# EAGLE design openautopihatv1point1 (EAGLE 8.3.1)
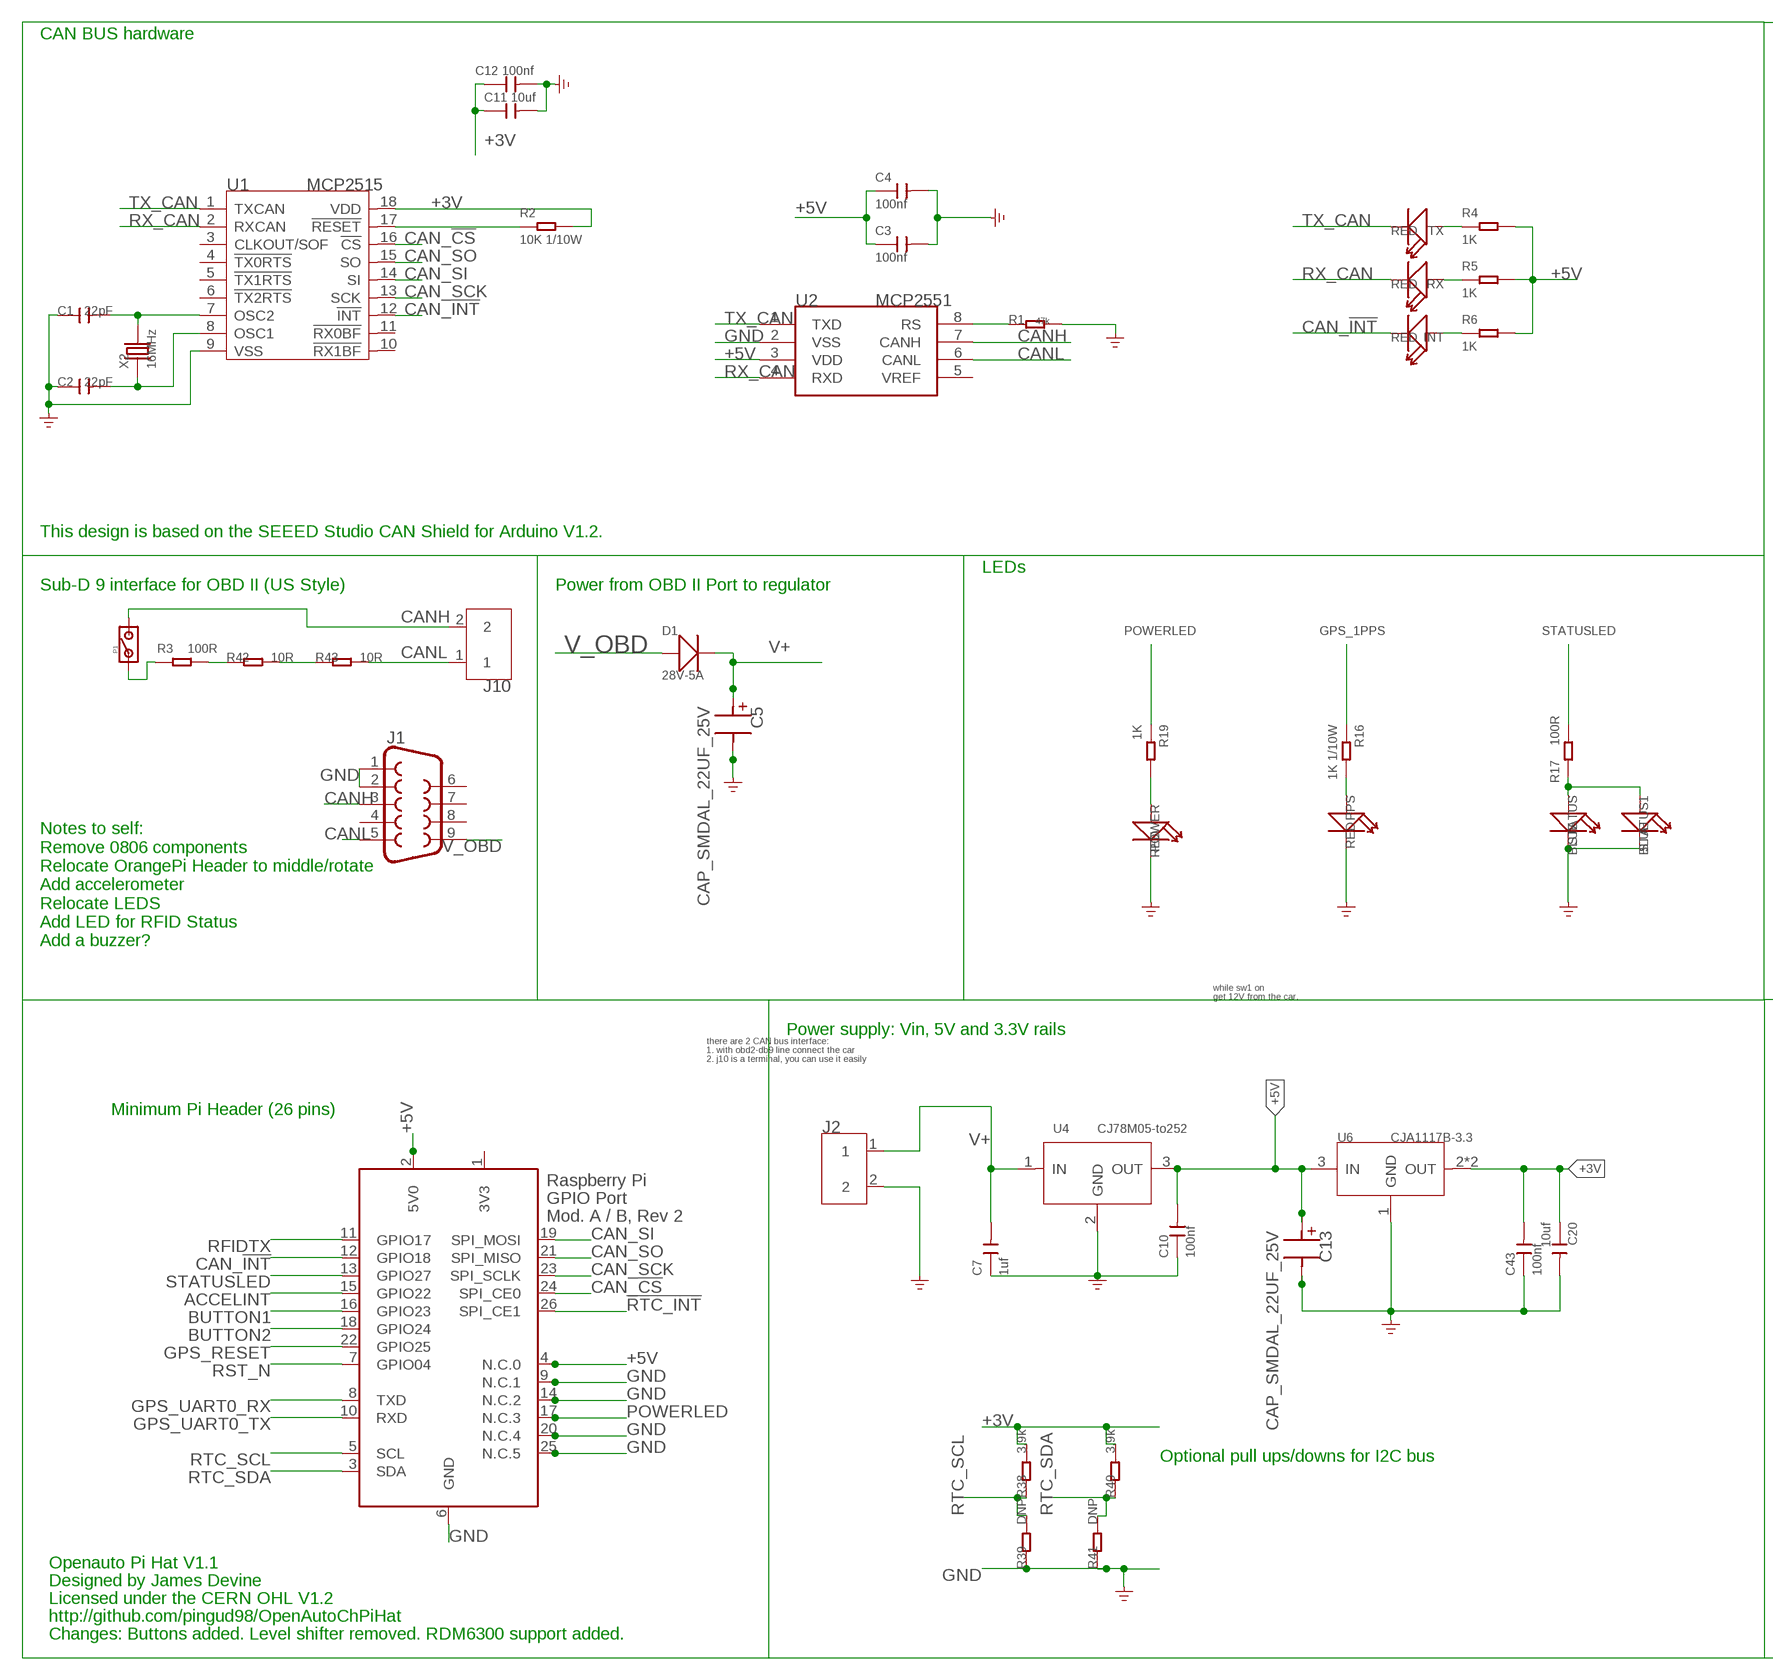
[diagram p0: schematic, sheet 1, part 1 of 2]
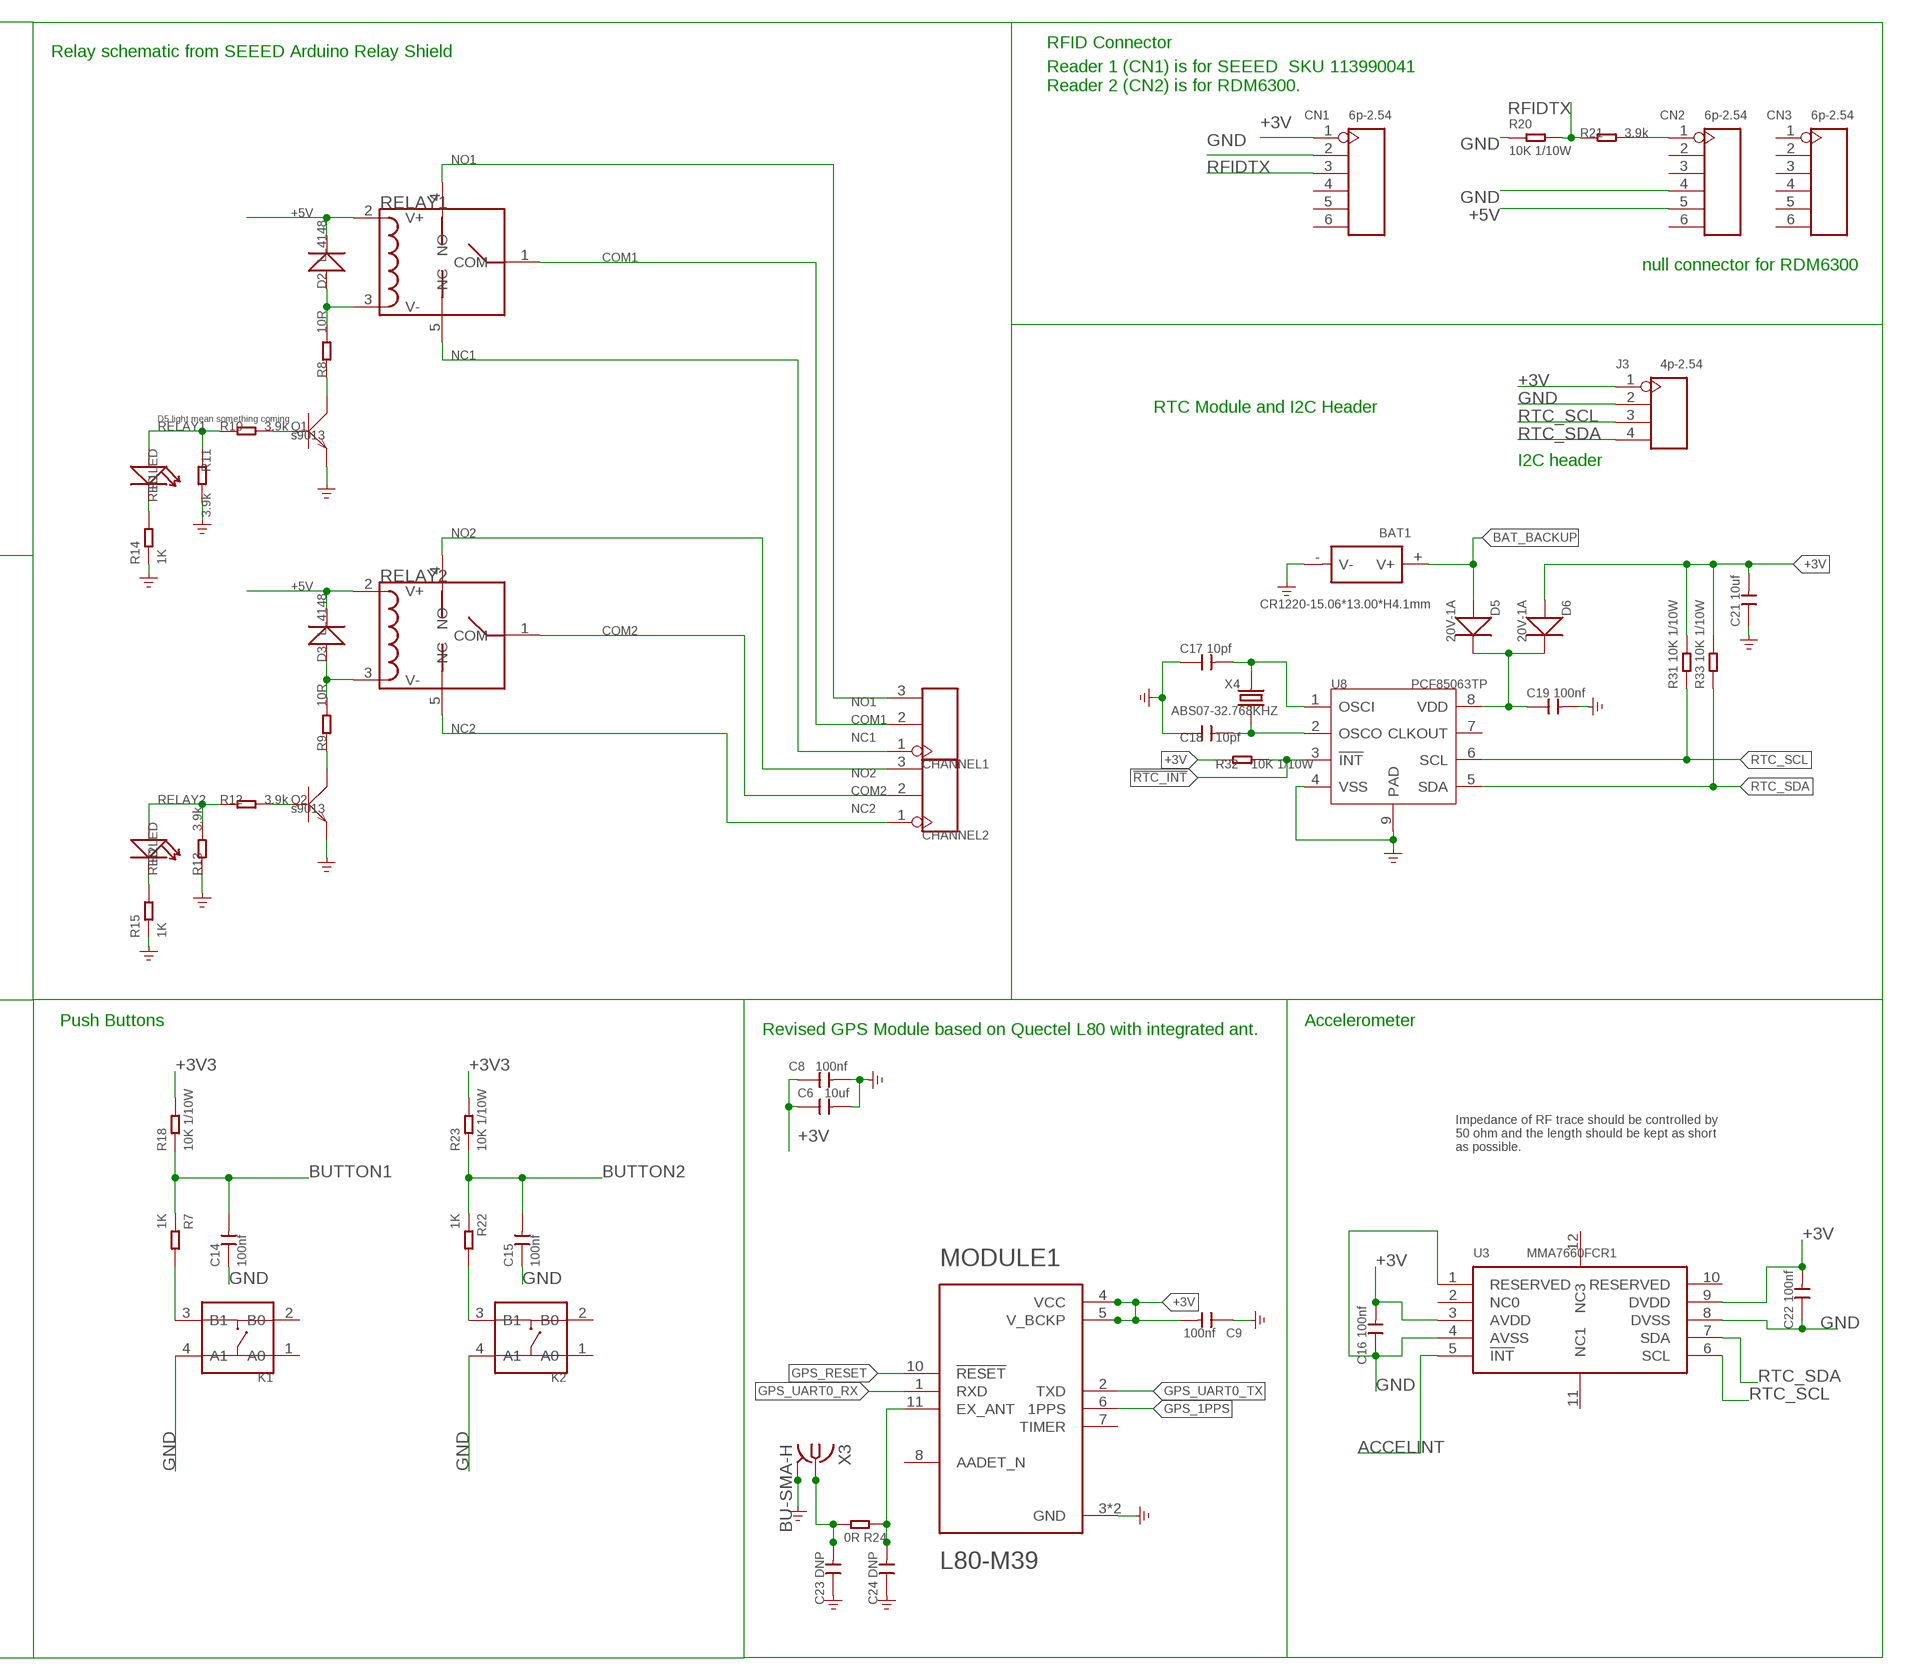
[diagram p1: schematic, sheet 1, part 2 of 2]

## Parts
BAT1  CR1220-15.06*13.00*H4.1mm  BAT-HOLDER'SMD-1220'  [BAT2P-SMD-16.4-CR1220]
C1  22pF  C-0603  [C0603]
C2  22pF  C-0603  [C0603]
C3  100nf  CERAMIC-100NF-50V-10%-X7R(0603)  [C0603]
C4  100nf  CERAMIC-100NF-50V-10%-X7R(0603)  [C0603]
C5  CAP_SMDAL_22UF_25V  [CAP_SMD_AL_D50]
C6  10uf  CERAMIC-10UF-25V-10%-X5R(0805)  [C0805]
C7  1uf  CERAMIC-1UF-25V-10%-X7R(0603)  [C0603]
C8  100nf  CERAMIC-100NF-50V-10%-X7R(0603)  [C0603]
C9  100nf  CERAMIC-100NF-50V-10%-X7R(0603)  [C0603]
C10  100nf  CERAMIC-100NF-50V-10%-X7R(0603)  [C0603]
C11  10uf  CERAMIC-10UF-25V-10%-X5R(0805)  [C0805]
C12  100nf  CERAMIC-100NF-50V-10%-X7R(0603)  [C0603]
C13  CAP_SMDAL_22UF_25V  [CAP_SMD_AL_D50]
C14  100nf  CERAMIC-100NF-50V-10%-X7R(0603)  [C0603]
C15  100nf  CERAMIC-100NF-50V-10%-X7R(0603)  [C0603]
C16  100nf  CERAMIC-100NF-50V-10%-X7R(0603)  [C0603]
C17  10pf  CERAMIC-10PF-50V-5%-NPO(0603)  [C0603]
C18  10pf  CERAMIC-10PF-50V-5%-NPO(0603)  [C0603]
C19  100nf  CERAMIC-100NF-50V-10%-X7R(0603)  [C0603]
C20  10uf  CERAMIC-10UF-25V-10%-X5R(0805)  [C0805]
C21  10uf  CERAMIC-10UF-25V-10%-X5R(0805)  [C0805]
C22  100nf  CERAMIC-100NF-50V-10%-X7R(0603)  [C0603]
C23  DNP  CERAMIC-1NF-50V-5%-C0G(0603)  [C0603]
C24  DNP  CERAMIC-1NF-50V-5%-C0G(0603)  [C0603]
C43  100nf  CERAMIC-100NF-50V-10%-X7R(0603)  [C0603]
CHANNEL1  SCREW-TERMINAL-3P'3.5'  [3P-3.5]
CHANNEL2  SCREW-TERMINAL-3P'3.5'  [3P-3.5]
CN1  6p-2.54  DIP-BLACK-FEMALE-HEADER-VERT(6P-2.54)  [H6-2.54]
CN2  6p-2.54  DIP-BLACK-FEMALE-HEADER-VERT(6P-2.54)  [H6-2.54]
CN3  6p-2.54  DIP-BLACK-FEMALE-HEADER-VERT(6P-2.54)  [H6-2.54]
D1  28V-5A  SMD-DIODE-SCHOTTKY-28V-5A(DO-214AA)  [DO-214AA]
D2  LL4148  D'1N4148-SMD'  [LL-34]
D3  LL4148  D'1N4148-SMD'  [LL-34]
D5  20V-1A  SMD-DIODE-SCHOTTKY-20V-1A(SOD-123)  [SOD-123]
D6  20V-1A  SMD-DIODE-SCHOTTKY-20V-1A(SOD-123)  [SOD-123]
INT  RED  LED'0603'  [LED-0603]
J1  DB9MALE  [DB9_MALE]
J2  SCREW-TERMINAL-2P5.0  [2P-5.0]
J3  4p-2.54  DIP-BLACK-FEMALE-HEADER-VERT(4P-2.54)  [H4-2.54]
J10  SCREW-TERMINAL-2P5.0  [2P-5.0]
K1  DIP-SWITCH-TACTILE-SPST-NO/TS-1109(4P-D6.0MM)'TS-1109'  [SW4-6.0X6.0X5.0MM]
K2  DIP-SWITCH-TACTILE-SPST-NO/TS-1109(4P-D6.0MM)'TS-1109'  [SW4-6.0X6.0X5.0MM]
MODULE1  L80-M39  [QUECTEL_L80-M39]
P1  PAD-JUMPER-2P  [2P-SMD-1.78X1.27]
POWER  RED  LED'0603'  [LED-0603]
PPS  RED  LED'0603'  [LED-0603]
Q1  s9013  TRANSISTOR-NPN-SOT23  [SOT23]
Q2  s9013  TRANSISTOR-NPN-SOT23  [SOT23]
R1  47k  R-0603  [0603]
R1LED  RED  LED'0603'  [LED-0603]
R2  10K 1/10W  SMD-RES-10K-5%-1/10W(0603)  [R0603]
R2LED  RED  LED'0603'  [LED-0603]
R3  100R  SMD-RES-100R-5%-1/10W(0603)  [R0603]
R4  1K  SMD-RES-1K-1%-1/10W(0603)  [R0603]
R5  1K  SMD-RES-1K-1%-1/10W(0603)  [R0603]
R6  1K  SMD-RES-1K-1%-1/10W(0603)  [R0603]
R7  1K  SMD-RES-1K-1%-1/10W(0603)  [R0603]
R8  10R  R-0603  [R0603]
R9  10R  R-0603  [R0603]
R10  3.9k  R-0603  [R0603]
R11  3.9k  R-0603  [R0603]
R12  3.9k  R-0603  [R0603]
R13  3.9k  R-0603  [R0603]
R14  1K  SMD-RES-1K-1%-1/10W(0603)  [R0603]
R15  1K  SMD-RES-1K-1%-1/10W(0603)  [R0603]
R16  1K 1/10W  SMD-RES-1K-5%-1/10W(0603)  [R0603]
R17  100R  SMD-RES-100R-5%-1/10W(0603)  [R0603]
R18  10K 1/10W  SMD-RES-10K-5%-1/10W(0603)  [R0603]
R19  1K  SMD-RES-1K-1%-1/10W(0603)  [R0603]
R20  10K 1/10W  SMD-RES-10K-5%-1/10W(0603)  [R0603]
R21  3.9k  R-0603  [R0603]
R22  1K  SMD-RES-1K-1%-1/10W(0603)  [R0603]
R23  10K 1/10W  SMD-RES-10K-5%-1/10W(0603)  [R0603]
R24  0R  SMD-RES-0R-5%-1/10W(0603)  [R0603]
R31  10K 1/10W  SMD-RES-10K-5%-1/10W(0603)  [R0603]
R32  10K 1/10W  SMD-RES-10K-5%-1/10W(0603)  [R0603]
R33  10K 1/10W  SMD-RES-10K-5%-1/10W(0603)  [R0603]
R38  3.9k  R-0603  [R0603]
R39  DNP  R-0603  [R0603]
R40  3.9k  R-0603  [R0603]
R41  DNP  R-0603  [R0603]
R42  10R  R-0603  [R0603]
R43  10R  R-0603  [R0603]
RELAY1  RELAY-HLS8L-DC5V-S-C  [5P-19.0X15.5X15.8H]
RELAY2  RELAY-HLS8L-DC5V-S-C  [5P-19.0X15.5X15.8H]
RX  RED  LED'0603'  [LED-0603]
STATUS  BLUE  LED'0603'  [LED-0603]
STATUS1  BLUE  LED'0603'  [LED-0603]
TX  RED  LED'0603'  [LED-0603]
U1  MCP2515  MCP2515-SOIC18  [SOIC18]
U2  MCP2551  MCP2551-SOIC8  [SOIC8-6.0]
U3  MMA7660FCR1  MOTION/POSITION-MMA7660FCR1(DFN10)  [DFN10-0.5-3.0X3.0MM]
U4  CJ78M05-to252  PMIC-CJ78M05(TO-252)  [TO-252]
U6  CJA1117B-3.3  PMIC-CJ1117'SOT89'  [SOT-89]
U8  PCF85063TP  RTC-PCF85063TP  [HWSON8-0.5-2X3X0.75MM]
X1  RASPI_GPIO_AB_PIN  [RASPI_GPIO_AB_PIN]
X2  16MHz  CRYSTAL-HC49S  [HC49/S]
X3  BU-SMA-H  [BU-SMA-H]
X4  ABS07-32.768KHZ  CRYSTAL-2P-3215  [X2-SMD-3.2X1.5X0.55MM]

## Nets
!RTC_INT: R32.2 U8.3(!INT) X1.26(SPI_CE1)
+3V: C6.1 C8.1 C9.2 C11.1 C12.1 C16.2 C20.1 C21.2 C22.2 C43.2 CN1.1 D6.+ J3.1 MODULE1.4(VCC) MODULE1.5(V_BCKP) R2.2 R31.2 R32.1 R33.2 R38.2 R40.2 U1.18(VDD) U3.3(AVDD) U3.9(DVDD) U6.2(OUT) U6.4(OUT)
+3V3: R18.2 R23.2
+5V [5V Line]: C3.1 C4.1 C10.2 C13.P$P CN2.5 D2.C(-) D3.C(-) R4.2 R5.2 R6.2 RELAY1.2(V+) RELAY2.2(V+) U2.3(VDD) U4.3(OUT) U6.3(IN) X1.2(5V0) X1.4(N.C.0)
ACCELINT: U3.5(!INT) X1.15(GPIO22)
BAT_BACKUP: BAT1.+(V+) D5.+
BUTTON1: C14.2 R7.1 R18.1 X1.16(GPIO23)
BUTTON2: C15.2 R22.1 R23.1 X1.18(GPIO24)
CAN_!CS: U1.16(!CS) X1.24(SPI_CE0)
CAN_!INT: INT.- U1.12(!INT) X1.12(GPIO18)
CAN_SCK: U1.13(SCK) X1.23(SPI_SCLK)
CAN_SI: U1.14(SI) X1.19(SPI_MOSI)
CAN_SO: U1.15(SO) X1.21(SPI_MISO)
CANH: J1.3 J10.2 P1.2 U2.7(CANH)
CANL: J1.5 J10.1 R43.2 U2.6(CANL)
COM1: CHANNEL1.2 RELAY1.1(COM)
COM2: CHANNEL2.2 RELAY2.1(COM)
GND [Batt]: BAT1.-(V-) C1.1 C2.1 C3.2 C4.2 C5.P$M C6.2 C7.1 C8.2 C9.1 C10.1 C11.2 C12.2 C13.P$M C14.1 C15.1 C16.1 C17.1 C18.1 C19.2 C20.2 C21.1 C22.1 C23.1 C24.1 C43.1 CN1.2 CN2.4 J1.1 J1.2 J2.2 J3.2 K1.4(A1) K2.4(A1) MODULE1.3(GND) MODULE1.12(GND) POWER.- PPS.- Q1.2(E) Q2.2(E) R1.2 R11.2 R13.1 R14.1 R15.1 R20.1 R39.1 R41.1 STATUS1.- STATUS.- U1.9(VSS) U2.2(VSS) U3.1(RESERVED) U3.4(AVSS) U3.8(DVSS) U4.2(GND) U6.1(GND) U8.4(VSS) U8.9(PAD) X1.6(GND) X1.9(N.C.1) X1.14(N.C.2) X1.20(N.C.4) X1.25(N.C.5) X3.2 X3.3 X3.4 X3.5 ; supply symbol labelled GND_POWER
GPS_1PPS: MODULE1.6(1PPS) R16.1
GPS_RESET: MODULE1.10(!RESET) X1.22(GPIO25)
GPS_UART0_RX: MODULE1.1(RXD) X1.8(TXD)
GPS_UART0_TX: MODULE1.2(TXD) X1.10(RXD)
N$1: K1.3(B1) R7.2
N$2: R4.1 TX.+
N$4 [5V Line]: Q2.1(B) R12.2
N$5 [5V Line]: D3.A(+) R9.2 RELAY2.3(V-)
N$6 [5V Line]: Q1.3(C) R8.1
N$7 [5V Line]: D2.A(+) R8.2 RELAY1.3(V-)
N$8 [5V Line]: Q2.3(C) R9.1
N$9: PPS.+ R16.2
N$10: R17.2 STATUS1.+ STATUS.+
N$11: R3.1 R42.1
N$12: R1LED.- R14.2
N$13: R2LED.- R15.2
N$14: C24.2 MODULE1.11(EX_ANT) R24.1
N$15: R5.1 RX.+
N$16: C1.2 U1.7(OSC2) X2.2
N$17: C2.2 U1.8(OSC1) X2.1
N$18: C23.2 R24.2 X3.1
N$19: INT.+ R6.1
N$20: R1.1 U2.8(RS)
N$23 [5V Line]: Q1.1(B) R10.2
N$24: CN2.1 R21.2
N$25: K2.3(B1) R22.2
N$29: POWER.+ R19.2
N$30: P1.1 R3.2
N$40: C18.2 U8.2(OSCO) X4.1
N$41: C17.2 U8.1(OSCI) X4.2
N$45: R42.2 R43.1
N$49: C19.1 D5.- D6.- U8.8(VDD)
NC1: CHANNEL1.1 RELAY1.5(NC)
NC2: CHANNEL2.1 RELAY2.5(NC)
NO1: CHANNEL1.3 RELAY1.4(NO)
NO2: CHANNEL2.3 RELAY2.4(NO)
POWERLED: R19.1 X1.17(N.C.3)
RELAY1 [5V Line]: R1LED.+ R10.1 R11.1
RELAY2: R2LED.+ R12.1 R13.2
RFIDTX: CN1.3 R20.2 R21.1 X1.11(GPIO17)
RST_N: R2.1 U1.17(!RESET) X1.7(GPIO04)
RTC_SCL: J3.3 R31.1 R38.1 R39.2 U3.6(SCL) U8.6(SCL) X1.5(SCL)
RTC_SDA: J3.4 R33.1 R40.1 R41.2 U3.7(SDA) U8.5(SDA) X1.3(SDA)
RX_CAN: RX.- U1.2(RXCAN) U2.4(RXD)
STATUSLED: R17.1 X1.13(GPIO27)
TX_CAN: TX.- U1.1(TXCAN) U2.1(TXD)
V+ [Batt]: C5.P$P C7.2 D1.- J2.1 U4.1(IN)
V_OBD [Batt]: D1.+ J1.9
Unconnected: CN1.4 CN1.5 CN1.6 CN2.2 CN2.3 CN2.6 CN3.1 CN3.2 CN3.3 CN3.4 CN3.5 CN3.6 J1.4 J1.6 J1.7 J1.8 K1.1(A0) K1.2(B0) K2.1(A0) K2.2(B0) MODULE1.7(TIMER) MODULE1.8(AADET_N) U1.3(CLKOUT/SOF) U1.4(!TX0RTS) U1.5(!TX1RTS) U1.6(!TX2RTS) U1.10(!RX1BF) U1.11(!RX0BF) U2.5(VREF) U3.2(NC0) U3.10(RESERVED) U3.11(NC1) U3.12(NC3) U8.7(CLKOUT)

## Notes on the sheet
- CAN BUS hardware
- RFID Connector
- Relay schematic from SEEED Arduino Relay Shield
- Reader 1 (CN1) is for SEEED  SKU 113990041
  Reader 2 (CN2) is for RDM6300.
- null connector for RDM6300
- RTC Module and I2C Header
- D5 light mean something coming
- I2C header
- This design is based on the SEEED Studio CAN Shield for Arduino V1.2.
- LEDs
- Sub-D 9 interface for OBD II (US Style) | Power from OBD II Port to regulator
- Notes to self:
  Remove 0806 components
  Relocate OrangePi Header to middle/rotate
  Add accelerometer
  Relocate LEDS
  Add LED for RFID Status
  Add a buzzer?
- while sw1 on
- get 12V from the car,
- Push Buttons | Accelerometer
- Power supply: Vin, 5V and 3.3V rails | Revised GPS Module based on Quectel L80 with integrated ant.
- there are 2 CAN bus interface:
- 1. with obd2-db9 line connect the car
- 2. j10 is a terminal, you can use it easily
- Minimum Pi Header (26 pins)
- Impedance of RF trace should be controlled by 
  50 ohm and the length should be kept as short 
  as possible.
- short route
- Optional pull ups/downs for I2C bus
- Openauto Pi Hat V1.1
- Designed by James Devine
- Licensed under the CERN OHL V1.2
- http://github.com/pingud98/OpenAutoChPiHat
- Changes: Buttons added. Level shifter removed. RDM6300 support added.

## Power pins joined to a net without a drawn wire
3V3: X1.1(3V3)

## Library data of the parts
BAT1 = Connector-new:BAT-HOLDER: BAT2P-13.5-CR1220:320170002;BAT2P-SMD-20.5-CR1632:320170007;METAL-CR2032-D20.0*H6.3MM:320170003;METAL-CR2032-SMD:320170006;PLASTIC-CR1220-L15.06*W13.0*H4.1MM:320170000;PLASTIC-CR2032-L25.2*W15.6*H5.2MM:320170005;BAT2P-11.55-D12.55-CR1220:313010022
C1 C2 = Discrete:C*: Ceramic Capacitors
C3 C4 C8-C10 C12 C14-C16 C19 C22 C43 = Seeed-Capacitor:CERAMIC-100NF-50V-10%-X7R(0603): 302010138; MPN: CC0603KRX7R9BB104
C5 C13 = Seeed-OPL-2017-01-Capacitor-akita:CAP_SMDAL_22UF_25V: SMD CAP Aluminum 22uF-25V;D5.0*H5.4mm SKU: 302030003
C6 C11 C20 C21 = Seeed-Capacitor:CERAMIC-10UF-25V-10%-X5R(0805): 302010178; MPN: CC0805KKX5R8BB106
C7 = Seeed-Capacitor:CERAMIC-1UF-25V-10%-X7R(0603): 302010139; MPN: CC0603KRX7R8BB105
C17 C18 = Seeed-Capacitor:CERAMIC-10PF-50V-5%-NPO(0603): 302010097; MPN: CC0603JRNPO9BN100
C23 C24 = Seeed-Capacitor:CERAMIC-1NF-50V-5%-C0G(0603): 302010341; MPN: GRM1885C1H102JA01D; VALUE: 1nf
CHANNEL1 CHANNEL2 = Connector :SCREW-TERMINAL-3P
CN1-CN3 = Seeed-Connector:DIP-BLACK-FEMALE-HEADER-VERT(6P-2.54): 320030060; MPN: F185-1106A1BSYC1
D1 = Seeed-Diode:SMD-DIODE-SCHOTTKY-28V-5A(DO-214AA): 304020021; MPN: SS54B
D2 D3 = discrete:D*
D5 D6 = Seeed-Diode:SMD-DIODE-SCHOTTKY-20V-1A(SOD-123): 304020034; MPN: B5819W
INT POWER PPS R1LED R2LED RX STATUS STATUS1 TX = Discrete:LED*
J1 = SparkFun-Connectors:DB9: DB9 Connector Standard DB9 (D-Sub 9) serial connector. Can be used for CAN bus as well as RS485 and RS232. Footprint production proven. Here is the female version connector we sell at SparkFun: 9 Pin Female Serial Connector - PCB Mount <https://www.sparkfun.com/products/429> (PRT-00429) This connector has been used on the following SparkFun products: SparkFun RS232 Shifter - SMD <https://www.sparkfun.com/products/449> (PRT-00449) SparkFun RS232 Shifter SMD (No DB9) <https://www.sparkfun.com/products/8780> (PRT-08780); PROD_ID: CONN-09904
J2 J10 = Connector:SCREW-TERMINAL-2P
J3 = Seeed-Connector:DIP-BLACK-FEMALE-HEADER-VERT(4P-2.54): 320030017; MPN: F185-1104A1BSYA1
K1 K2 = Seeed-Switch:DIP-SWITCH-TACTILE-SPST-NO/TS-1109(4P-D6.0MM): 311020024
MODULE1 = L80-M39:L80-M39: GPS Receiver 1575.42MHz 3.3V 12-Pin; AVAILABILITY: Unavailable; DESCRIPTION: GPS Receiver 1575.42MHz 3.3V 12-Pin; MF: Quectel; MP: L80-M39; PACKAGE: None; PRICE: 7.60 USD
P1 = Discrete:PAD-JUMPER-2P
Q1 Q2 = discrete:TRANSISTOR-NPN*: NPN audion
R1 = Discrete:R*
R2 R18 R20 R23 R31-R33 = Seeed-Resistor:SMD-RES-10K-5%-1/10W(0603): 301010293; MPN: RC0603JR-0710KL
R3 R17 = Seeed-Resistor:SMD-RES-100R-5%-1/10W(0603): 301010090; MPN: RC0603JR-07100RL
R4-R7 R14 R15 R19 R22 = Seeed-Resistor:SMD-RES-1K-1%-1/10W(0603): 301010298; MPN: RC0603FR-071KL
R8-R13 R21 R38-R43 = discrete:R*
R16 = Seeed-Resistor:SMD-RES-1K-5%-1/10W(0603): 301010291; MPN: RC0603JR-071KL
R24 = Seeed-Resistor:SMD-RES-0R-5%-1/10W(0603): 301010292; MPN: RC0603JR-070RL
RELAY1 RELAY2 = discrete:RELAY-HLS8L-DC5V-S-C
U1 = IC:MCP2515: Stand-Alone CAN Controller With SPI Interface
U2 = IC:MCP2551: High-Speed CAN Transceiver http://ww1.microchip.com/downloads/en/devicedoc/21667f.pdf
U3 = Seeed-Sensor:MOTION/POSITION-MMA7660FCR1(DFN10): 314080009; MPN: MMA7660FCR1
U4 = Seeed-IC:PMIC-CJ78M05(TO-252): 310030100; MPN: CJ78M05
U6 = IC-new:PMIC-CJ*1117: Low Drop Fixed And Adjustable Positive Voltage Regulators http://www.datasheetcatalog.org/datasheet/SGSThomsonMicroelectronics/mXuqtqv.pdf
U8 = IC-new:RTC-PCF85063TP
X1 = raspberrypi_bastelstube_v13:RASPI_GPIO_AB: Only the 2x13 header connector, nothing else
X2 = Discrete:CRYSTAL*: CRYSTAL
X3 = con-coax:BU-SMA-H: FEMALE SMA CONNECTOR Radiall; OC_FARNELL: unknown; OC_NEWARK: unknown
X4 = Discrete-new:CRYSTAL-2P

## Net classes
0 default: width 0.152 mm, drill 0.152 mm, clearance 0.152 mm
1 Batt: width 0.305 mm, drill 0.152 mm, clearance 0.152 mm
2 5V Line: width 0.203 mm, drill 0.152 mm, clearance 0.152 mm

## Board
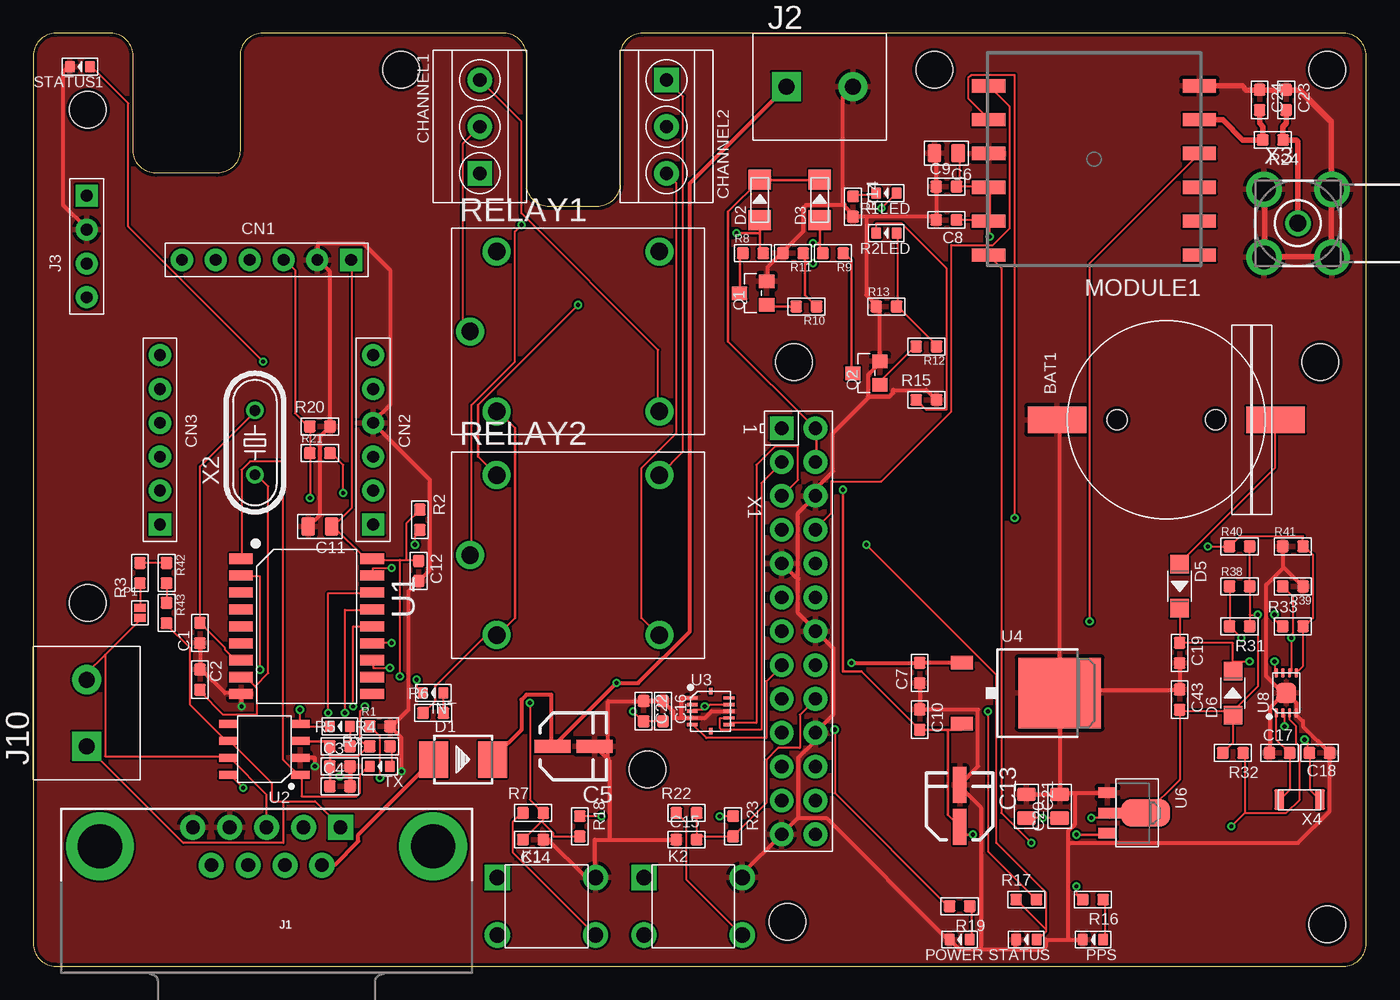
[diagram p2: board, top side]
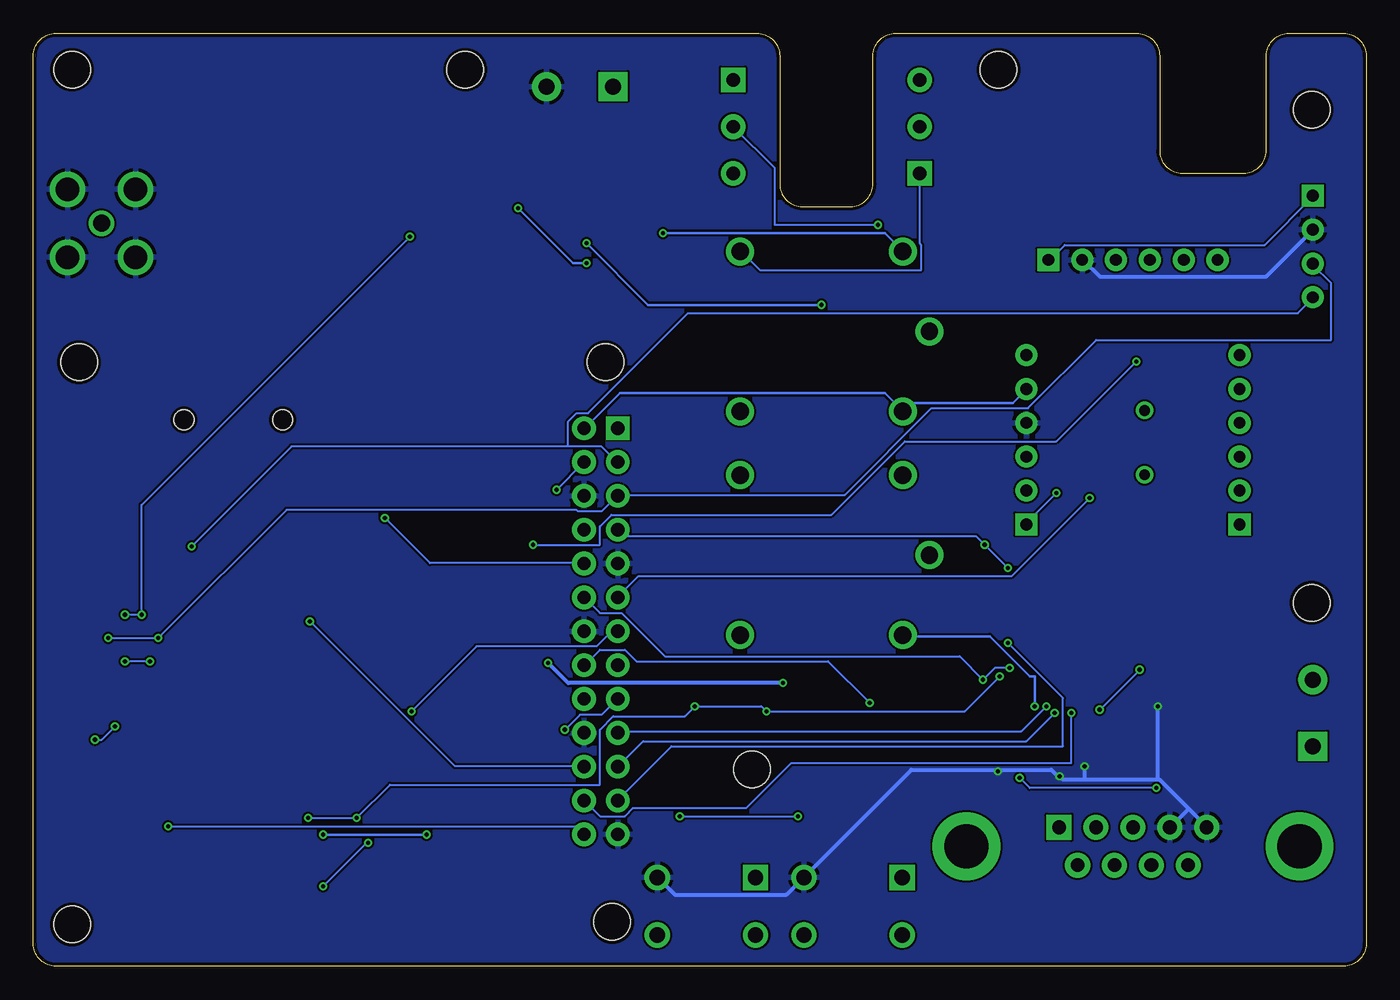
[diagram p3: board, bottom side, seen from below]

Size 100 x 70 mm. Coordinates in mm from the lower left corner, seen from the top.
Outline: 0,68.29 0,1.71 arc90 1.71,0 98.29,0 arc90 100,1.71 100,68.29 arc90 98.29,70 45.71,70 arc90 44,68.29 44,58.71 arc-90 42.29,57 38.71,57 arc-90 37,58.71 37,68.29 arc90 35.29,70 17.21,70 arc90 15.5,68.29 15.5,61.21 arc-90 13.79,59.5 9.21,59.5 arc-90 7.5,61.21 7.5,68.29 arc90 5.79,70 1.71,70 arc90 0,68.29
Copper layers (1*16): Top 0.035mm / dielectric 1.5mm / Bottom 0.035mm
Design rules "SeeedStudio_2layer_DRU_no_angle_20140221": minimum track width 6mil, minimum drill 12mil, track to track 6mil, track to pad 6mil, pad to pad 6mil, via to via 6mil, smd to smd 0mil, copper to edge 10mil, drill to drill 10mil, minimum pad ring 10mil, minimum via ring 6mil, stop-mask expansion 2mil, vias tented up to drill 100mil, thermal gap 10mil
Holes 2.75 mm at 97.09,3.13 97.09,67.27 96.57,45.33 4.09,64.27 4.09,27.27 57.07,45.33 56.57,3.33 27.59,67.27 67.59,67.27 46.09,14.77

### Footprints (pad centres in the part's own frame; a part is rotated, then mirrored left to right if it is on the bottom)
BAT2P-SMD-16.4-CR1220 = smd 2 x 4.4: + 0,-8.2; - 0,8.2 | hole 1.5: 0,3.7; 0,-3.7
C0603 = smd 0.889 x 0.889: 1 -0.762,0; 2 0.762,0
C0603' = smd 0.889 x 0.889: 1 0,0.762; 2 0,-0.762
CAP_SMD_AL_D50 = smd 1 x 2.7: P$M 0,-1.6; P$P 0,1.56
C0805 = smd 1.397 x 1.016: 1 0,0.889; 2 0,-0.889
3P-3.5 = drill 1 pad 1.85 square: 1 0,-3.5 | drill 1 pad 1.85: 2 0,0; 3 0,3.5
H6-2.54 = drill 0.889 pad 1.651 square: 1 0,6.35 | drill 0.889 pad 1.651: 2 0,3.81; 3 0,1.27; 4 0,-1.27; 5 0,-3.81; 6 0,-6.35
DO-214AA = smd 2.159 x 2.743: + -2.21,0; - 2.21,0
LL-34 = smd 1.524 x 1.676: A -1.524,0; C 1.524,0
SOD-123 = smd 1.397 x 1.397: + -1.651,0; - 1.651,0
LED-0603 = smd 0.762 x 0.889: + -0.762,0; - 0.762,0
DB9_MALE = drill 1.016 pad 1.88: 1 5.54,-1.42; 2 2.77,-1.42; 3 0,-1.42; 4 -2.77,-1.42; 6 4.15,1.42; 7 1.38,1.42; 8 -1.38,1.42; 9 -4.15,1.42 | drill 1.016 pad 1.88 square: 5 -5.54,-1.42 | drill 3.302 pad 5.08: G1 -12.5,0; G2 12.5,0
2P-5.0 = drill 1.2 pad 2.184 square: 1 0,0 | drill 1.2 pad 2.184: 2 5,0
H4-2.54 = drill 0.889 pad 1.651 square: 1 0,3.81 | drill 0.889 pad 1.651: 2 0,1.27; 3 0,-1.27; 4 0,-3.81
SW4-6.0X6.0X5.0MM = drill 1.143 pad 1.905 square: 1 -3.683,2.159 | drill 1.143 pad 1.905: 2 -3.683,-2.159; 3 3.683,-2.159; 4 3.683,2.159
QUECTEL_L80-M39 = smd 2.5 x 1: 1 7.9,-5.5; 2 7.9,-2.96; 3 7.9,-0.42; 4 7.9,2.12; 5 7.9,4.66; 6 7.9,7.2; 7 -7.9,7.2; 8 -7.9,4.66; 9 -7.9,2.12; 10 -7.9,-0.42; 11 -7.9,-2.96; 12 -7.9,-5.5
2P-SMD-1.78X1.27 = smd 0.889 x 0.61: 1 0,0.381; 2 0,-0.381
SOT23 = smd 1.016 x 1.143: 1 -0.889,-1.016; 2 0.889,-1.016; 3 0,1.016
0603 = smd 0.889 x 0.889: 1 -0.762,0; 2 0.762,0
R0603 = smd 0.889 x 0.889: 1 0,0.762; 2 0,-0.762
R0603' = smd 0.889 x 0.889: 1 -0.762,0; 2 0.762,0
5P-19.0X15.5X15.8H = drill 1.3 pad 2.1: 1 -8.1,0; 2 -6.1,-6; 3 -6.1,6; 4 6.1,-6; 5 6.1,6
SOIC18 = smd 0.762 x 1.778: 1 -5.08,-4.915; 2 -3.81,-4.915; 3 -2.54,-4.915; 4 -1.27,-4.915; 5 0,-4.915; 6 1.27,-4.915; 7 2.54,-4.915; 8 3.81,-4.915; 9 5.08,-4.915; 10 5.08,4.915; 11 3.81,4.915; 12 2.54,4.915; 13 1.27,4.915; 14 0,4.915; 15 -1.27,4.915; 16 -2.54,4.915; 17 -3.81,4.915; 18 -5.08,4.915
SOIC8-6.0 = smd 0.6 x 1.4: 1 -1.905,-2.7; 2 -0.635,-2.7; 3 0.635,-2.7; 4 1.905,-2.7; 5 1.905,2.7; 6 0.635,2.7; 7 -0.635,2.7; 8 -1.905,2.7
DFN10-0.5-3.0X3.0MM = smd 0.8 x 0.25: 1 -1.375,1; 2 -1.375,0.5; 3 -1.375,0; 4 -1.375,-0.5; 5 -1.375,-1; 6 1.375,-1; 7 1.375,-0.5; 8 1.375,0; 9 1.375,0.5; 10 1.375,1 | smd 0.25 x 0.5: 11 0,-1.5; 12 0,1.5
TO-252 = smd 1.016 x 1.651: 1 -2.286,-4.826; 3 2.286,-4.826 | smd 5.3 x 6.2: 2 0,2.5
SOT-89 = smd 0.8 x 1.4: 1 -1.524,-1.905; 3 1.524,-1.905 | smd 0.8 x 1.9: 2 0,-1.651 | smd 2.032 x 3.65: 4 0,0.94
HWSON8-0.5-2X3X0.75MM = smd 0.25 x 0.7: 1 -0.75,-1.5; 2 -0.25,-1.5; 3 0.25,-1.5; 4 0.75,-1.5; 5 0.75,1.5; 6 0.25,1.5; 7 -0.25,1.5; 8 -0.75,1.5 | smd 1.5 x 1.5: 9 0,0
RASPI_GPIO_AB_PIN = drill 1 pad 1.778 square: 1 -15.24,-1.27 | drill 1 pad 1.778: 2 -15.24,1.27; 3 -12.7,-1.27; 4 -12.7,1.27; 5 -10.16,-1.27; 6 -10.16,1.27; 7 -7.62,-1.27; 8 -7.62,1.27; 9 -5.08,-1.27; 10 -5.08,1.27; 11 -2.54,-1.27; 12 -2.54,1.27; 13 0,-1.27; 14 0,1.27; 15 2.54,-1.27; 16 2.54,1.27; 17 5.08,-1.27; 18 5.08,1.27; 19 7.62,-1.27; 20 7.62,1.27; 21 10.16,-1.27; 22 10.16,1.27; 23 12.7,-1.27; 24 12.7,1.27; 25 15.24,-1.27; 26 15.24,1.27
HC49/S = drill 0.813: 1 -2.413,0; 2 2.413,0
BU-SMA-H = drill 1.27: 1 0,0 | drill 1.778: 2 -2.55,2.55; 3 2.55,2.55; 4 2.55,-2.55; 5 -2.55,-2.55
X2-SMD-3.2X1.5X0.55MM = smd 0.762 x 1.524: 1 -1.524,0; 2 1.524,0

### Placement (x,y rotation side)
BAT1  85,41 90 top
C1  12.5,25 90 top
C2  12.5,21.5 270 top
C3  100nf  [C0603']  23,15 90 top
C4  100nf  [C0603']  23,13.5 90 top
C5  40.5,16.5 90 top
C6  68.5,61 270 top
C7  1uf  [C0603']  66.5,22 180 top
C8  100nf  [C0603']  68.5,56 270 top
C9  100nf  [C0603']  68.5,58.5 90 top
C10  100nf  [C0603']  66.5,18.5 0 top
C11  21.5,33 270 top
C12  100nf  [C0603']  28.91,29.66 0 top
C13  69.5,12 180 top
C14  100nf  [C0603']  37.5,9.5 270 top
C15  100nf  [C0603']  49,9.5 90 top
C16  100nf  [C0603']  47.24,19.14 0 top
C17  10pf  [C0603']  93.5,16 90 top
C18  10pf  [C0603']  96.5,16 270 top
C19  100nf  [C0603']  86,23.5 0 top
C20  77,12 180 top
C21  74.5,12 0 top
C22  100nf  [C0603']  45.8,19.14 0 top
C23  DNP  [C0603']  94,65 0 top
C24  DNP  [C0603']  92,65 0 top
C43  100nf  [C0603']  86,20 0 top
CHANNEL1  33.5,63 0 top
CHANNEL2  47.5,63 180 top
CN1  17.5,53 270 top
CN2  25.5,39.5 180 top
CN3  9.5,39.5 180 top
D1  32.24,15.51 0 top
D2  54.5,57.5 90 top
D3  59,57.5 90 top
D5  86,28.5 270 top
D6  90,20.5 90 top
INT  30,20.5 180 top
J1  17.5,9 180 top
J2  56.5,66 0 top
J3  4,54 0 top
J10  4,16.5 90 top
K1  38.5,4.5 0 top
K2  49.5,4.5 0 top
MODULE1  79.58,60.56 180 top
P1  8,26.5 0 top
POWER  69.5,2 180 top
PPS  79.5,2 180 top
Q1  54,50.5 90 top
Q2  62.5,44.5 90 top
R1  26,18 0 top
R1LED  64,58 180 top
R2  29,33.5 180 top
R2LED  64,55 180 top
R3  8,29.5 0 top
R4  26,16.5 270 top
R5  23,16.5 270 top
R6  30,19 270 top
R7  37.5,11.5 270 top
R8  10R  [R0603']  54,53.5 0 top
R9  10R  [R0603']  60,53.5 180 top
R10  3.9k  [R0603']  58,49.5 180 top
R11  3.9k  [R0603']  57,53.5 180 top
R12  3.9k  [R0603']  67,46.5 180 top
R13  3.9k  [R0603']  64,49.5 0 top
R14  61.5,57 180 top
R15  67,42.5 270 top
R16  79.5,5 90 top
R17  74.5,5 270 top
R18  41,10.5 180 top
R19  69.5,4.5 90 top
R20  21.5,40.5 270 top
R21  3.9k  [R0603']  21.5,38.5 0 top
R22  49,11.5 270 top
R23  52.5,10.5 180 top
R24  93,62 90 top
R31  90.5,25.5 90 top
R32  90,16 90 top
R33  94.5,25.5 270 top
R38  3.9k  [R0603']  90.5,28.5 0 top
R39  DNP  [R0603']  94.5,28.5 180 top
R40  3.9k  [R0603']  90.5,31.5 0 top
R41  DNP  [R0603']  94.5,31.5 0 top
R42  10R  [R0603']  10,29.5 270 top
R43  10R  [R0603']  10,26.5 270 top
RELAY1  40.87,47.63 0 top
RELAY2  40.87,30.85 0 top
RX  23,18 180 top
STATUS  74.5,2 180 top
STATUS1  3.5,67.5 180 top
TX  26,15 180 top
U1  20.5,25.5 270 top
U2  17.33,16.28 90 top
U3  50.82,19.14 0 top
U4  74.5,20.5 270 top
U6  82.5,11.5 270 top
U8  94,20.5 0 top
X1  57.41,25.13 270 top
X2  16.63,39.29 90 top
X3  94.88,55.74 0 top
X4  95,12.5 180 top

### Tracks (layer width: path | path; a pad name or v marks a point on that pad's centre or on a via)
!RTC_INT  (via drill 0.3)
  Top 0.152: U8.3 94.25,18.5 94.75,18 94.75,16.75 95,16.5 95,12.5 94,11.5 90.88,11.5 | 90.88,11.5 90.88,16 R32.2 | 90.88,11.5 v89.88,10.5
  Bottom 0.152: v89.88,10.5 59.25,10.5 58.75,10 X1.26
+3V  (via drill 0.3)
  Top 0.152: 27.5,30.5 25.5,30.5 U1.18 25.38,30.62 24.88,30.62 22.5,33 | 27.5,30.5 28,30.5 | 28,30.5 28.88,30.5 C12.1 | 28,30.5 28,33.25 R2.2 | 22.5,33 23.88,34.38 23.88,53 CN1.1 | 22.5,33 C11.1 | C16.2 47.12,18.38 45.88,18.38 C22.2 45.75,18.38 v45,19.12 | 50.5,19.38 50.75,19.62 52.12,19.62 U3.9 | 50.5,19.38 50.38,19.25 49.5,19.25 U3.3 | 50.5,19.38 v50.38,19.5 | C21.2 74.5,11.12 v75.75,11.12 77,11.12 C20.1 | v79.38,11.12 80.75,11.12 80.75,11.5 U6.2 U6.4 83.5,11.5 86,14 86,19.12 | C8.1 71.62,56 MODULE1.5 | 69.5,58.5 71.62,58.5 MODULE1.4 71.75,58.38 71.75,56 MODULE1.5 | 69.5,58.5 C9.2 69.38,58.5 | 69.5,58.5 69.5,61 C6.1 | 90,19.12 86,19.12 | D6.+ 90,19.12 | D6.+ 90,16.75 R32.1 | R38.2 91.25,26.38 | 91.25,26.38 R31.2 | R38.2 R40.2 | R38.2 | v93.12,26.38 93.12,26 93.62,25.5 R33.2 | 91.25,26.38 v91.88,26.38 91.88,21 90,19.12 | 90,18.88 D6.+ | v71.75,54.75 71.75,55.88 MODULE1.5 | 86,19.12 C43.2 | v27.5,21.75 27.5,30.5
  Bottom 0.152: J3.1 4,57.75 7.62,54.12 22.62,54.12 23.75,53 CN1.1 | v79.38,11.12 v75.75,11.12 73.25,13.62 57.5,13.62 57.5,17.75 56.5,18.75 51.12,18.75 v50.38,19.5 45.38,19.5 v45,19.12 30.12,19.12 v27.5,21.75 | v93.12,26.38 v91.88,26.38 91.88,34.62 v71.75,54.75
+3V3  (via drill 0.3)
  Top 0.152: v42.62,11.25 R18.2 | v51.5,11.25 R23.2
  Bottom 0.152: v51.5,11.25 v42.62,11.25
+5V  (via drill 0.3)
  Top 0.203: C3.1 C4.1 | C3.1 22.25,15.75 | 22.25,15.75 R5.2 22.12,16.5 22.12,16.88 20.12,16.88 U2.3 | C3.1 | 22.25,15.75 24.38,15.75 25.12,16.5 R4.2 25,16.5 24.5,17 24.5,19.12 v24.88,19.5 | R6.2 30.12,19.88 30.12,21 33.88,24.75 34.75,24.75 RELAY2.2 34.88,24.88 36.12,26.12 36.12,40.38 34.88,41.62 RELAY1.2 | 68.62,17.75 69.62,17.75 69.62,18.12 U4.3 | 68.62,17.75 C10.2 | v78.25,9.88 80.5,9.88 U6.3 | v70.5,9.88 69.5,9.88 C13.P$P 69.5,10.5 68.62,11.38 68.62,17.75 | 54.5,59 59,59 D3.C | 54.5,59 52.12,56.62 52.12,46.88 58.62,40.38 X1.2 58.75,40.25 58.75,37.88 X1.4 | 54.5,59 D2.C | C10.2 62.12,22.12 60.75,22.12 v60.75,35.75 | C10.2
  Bottom 0.203: CN2.5 25.5,43.25 26.5,42.25 34.25,42.25 34.75,41.75 RELAY1.2 34.88,41.75 36.12,43 56,43 58.62,40.38 X1.2 | v24.88,19.5 24.88,21.75 25.25,21.75 28.25,24.75 34.75,24.75 RELAY2.2 | v70.5,9.88 v78.25,9.88 | v60.75,35.75 58.75,37.75 X1.4
ACCELINT
  Top 0.152: U3.5 49.5,18.12 50.5,17.12 55,17.12 55,21.38 56.12,22.5 X1.15
BAT_BACKUP
  Top 0.152: D5.+ 86,30.25 93.12,37.38 93.12,41 BAT1.+
BUTTON1  (via drill 0.3)
  Top 0.152: 38.12,10.88 38.25,11 R7.1 | 38.12,10.88 C14.2 | 38.12,10.88 39,10 39,9.75 R18.1 | R7.1 37.25,12.5 v37.25,19.75 | R7.1
  Bottom 0.152: v37.25,19.75 40.38,22.88 54.75,22.88 55.62,23.75 57.5,23.75 58.62,22.62 X1.16
BUTTON2
  Top 0.152: 49.75,9.75 R22.1 | 49.75,9.75 C15.2 49.75,9.75 | 49.75,9.75 R23.1 | R23.1 55,12.25 55,15.5 55.88,16.38 57.5,16.38 57.5,18.88 58.62,20 X1.18 | R23.1
CAN_!CS  (via drill 0.3)
  Top 0.152: v22.12,19 22.12,28 25.38,28 U1.16
  Bottom 0.152: v22.12,19 22.12,15.25 43.12,15.25 46.5,11.88 55,11.88 55.62,11.25 57.5,11.25 58.62,12.38 X1.24
CAN_!INT  (via drill 0.3)
  Top 0.152: v28.75,21.5 28.75,20.88 29.12,20.5 INT.- | v26.75,22.38 25.5,22.38 25.5,22.88 U1.12
  Bottom 0.152: v26.75,22.38 27.88,22.38 v28.75,21.5 30.5,23.25 52.62,23.25 55.88,26.5 57.5,26.5 58.62,27.62 X1.12
CAN_SCK  (via drill 0.3)
  Top 0.152: v26.88,24.25 25.5,24.25 U1.13
  Bottom 0.152: v26.88,24.25 22.75,20.12 22.75,16.5 52.12,16.5 56.12,12.5 X1.23
CAN_SI  (via drill 0.3)
  Top 0.152: U1.14 24,25.5 v24,19.5
  Bottom 0.152: v24,19.5 25.88,17.62 56.12,17.62 X1.19
CAN_SO  (via drill 0.3)
  Top 0.152: v23.38,19 23.38,26.75 25.38,26.75 U1.15
  Bottom 0.152: v23.38,19 25.5,16.88 54.25,16.88 56.12,15 X1.21
CANH
  Top 0.152: J1.3 17.5,12.88 14.75,15.62 U2.7 14.62,15.75 5.38,15.75 5.38,23.38 | 5.38,23.38 4,22 J10.2 | 5.38,23.38 8,26 P1.2
CANL
  Top 0.152: R43.2 10,25.62 11.75,23.88 11.75,19.62 14.38,17 14.62,17 U2.6 14.75,16.88 17.88,13.75 17.88,12.38 18.75,12.38 | 18.75,12.38 21.12,12.38 23,10.5 J1.5 | J10.1 11.25,9.25 18.75,9.25 18.75,12.38
COM1
  Top 0.152: CHANNEL1.2 32.25,61.75 32.25,48.25 32.75,47.75 RELAY1.1
COM2  (via drill 0.3)
  Top 0.152: v36.62,55.62 36.12,55.12 36.12,45.38 32.88,42.12 32.88,30.88 RELAY2.1
  Bottom 0.152: CHANNEL2.2 44.38,59.88 44.38,55.62 v36.62,55.62
GND  (via drill 0.3)
  Top 0.305: STATUS1.- 2.62,67.5 2.25,67.12 2.25,57.12 4,55.38 J3.2 | C11.2 20.62,33 21.5,33.88 21.5,39.75 R20.1 22.25,40.62 22.25,52.12 21.38,53 CN1.2 21.38,53.12 21.38,54.25 24.75,54.25 26.75,52.25 26.75,42.12 25.5,40.88 CN2.4 25.5,40.75 29.75,36.5 29.75,29.75 29,29 C12.2 28.88,28.88 28.12,28.12 28.12,19.25 26.88,18 R1.2 26.88,17.88 27.62,17.12 v27.62,14.62 | 93.81,29.94 93.75,30 R41.1 | 93.81,29.94 R39.1 | U8.9 94.75,19.75 U8.4 94.75,18.88 95.25,18.38 95.25,18 C18.1 97.25,15.88 97.25,11.62 94.88,9.25 77.62,9.25 | C17.1 92.75,19.38 93.88,20.5 U8.9 | 93.81,29.94 92.5,28.62 92.5,21.75 93.75,20.5 U8.9 | C7.1 C10.1 66.62,19.25 70.88,19.25 70.88,15 69.5,13.62 C13.P$M 69.5,13.5 71.12,11.88 71.12,1.25 | 73.62,1.25 71.12,1.25 | 71.12,1.25 69.5,1.25 POWER.- 68.62,2 59.5,11.12 57.38,11.12 | 73.62,1.25 73.62,2 STATUS.- | 77.62,2 76,2 76,1.5 75.75,1.25 73.62,1.25 | 77.62,2 PPS.- | C21.1 74.5,12.88 77,12.88 C20.2 | 78.12,13 77,13 C20.2 | 78.12,13 80.5,13 U6.1 | C19.2 C43.1 85.88,20.75 77,20.75 U4.2 | U4.2 C20.2 | 77.62,9.25 77.62,10.12 78.12,10.62 78.12,13 | 77.62,9.25 77.62,2 | U4.2 77,40.88 76.88,41 BAT1.- | C24.1 | C23.1 | 92.38,53.25 X3.5 92.5,53.25 | X3.2 92.38,58.25 | 97.38,53.25 X3.4 97.38,53.38 | X3.3 97.38,58.25 | 62.62,42.75 64.25,42.75 64.5,43 64.5,43.25 67,43.25 R15.1 | 62.62,42.75 62.62,44.38 63.5,45.25 Q2.2 63.5,45.5 63.5,49.25 R13.1 63.25,49.62 62.5,50.38 62.5,56.25 | Q1.2 55.12,51.5 55.12,52.5 56.12,53.5 R11.2 56.25,53.62 57.75,55.12 57.75,56.88 58,57.12 60.75,57.12 | 62.5,56.25 67.62,56.25 C8.2 C9.1 67.75,58.62 67.75,60.88 67.62,61 C6.2 | 62.5,56.25 R14.1 61.5,56.38 60.88,57 60.88,57.12 60.75,57.12
  Top 0.305: J2.2 60.75,65.25 60.75,57.12 | C1.1 C2.1 12.62,22.25 14.38,20.5 15.5,20.5 U1.9 15.62,20.38 v15.62,19.5 | 23.75,14.25 C3.2 | 23.75,14.25 C4.2 | v23,14.25 23.75,14.25 | v21.12,15 21.12,15.62 20.12,15.62 U2.2 | 48.62,18.62 48,18.62 48,19.12 47.25,19.88 C16.1 47.12,19.88 45.88,19.88 C22.1 45.75,19.88 43.12,19.88 43.12,15.62 43.06,15.56 | 48.62,18.62 49.38,18.62 U3.4 49.5,18.62 50.38,18.62 50.88,19.12 52.12,19.12 U3.8 | 48.62,18.62 48.62,20.12 49.38,20.12 U3.1 | C14.1 38.62,9.5 41.38,6.75 42.12,6.75 K1.4 42.12,6.88 42.12,9.5 43.25,9.5 | 43.25,9.5 C15.1 | 43.06,15.56 43.25,15.38 43.25,9.5 | 43.06,15.56 42.12,16.5 C5.P$M | K2.4 53.25,6.75 53.25,7 56.12,9.88 X1.25 56.25,10 57.38,11.12 | 57.31,29.06 57.38,29 57.38,26.5 58.62,25.25 X1.14 58.75,25.12 60,23.88 60,18.88 58.75,17.62 X1.20 58.62,17.38 58.62,16.88 57.38,15.62 57.38,11.12 | 57.31,29.06 56.25,30.12 X1.9 | 57.31,29.06 57.38,29.12 57.38,34 58.62,35.25 X1.6 58.75,35.38 58.75,35.88 60,37.12 60,40 62.62,42.62 62.62,42.75
  Top 0.406: MODULE1.12 90.69,66.06 91,65.75 C24.1 C23.1 95,65.75 97.38,63.38 97.38,58.25 97.38,53.25 | 97.38,53.25 X3.4 97.38,53.25 | 92.5,53.25 97.38,53.25 | 92.38,58.25 92.38,53.24 X3.5
  Bottom 0.305: J3.2 4,55.25 7.5,51.75 20,51.75 21.25,53 CN1.2 | 15.62,14 15.5,14 13.31,11.81 | 15.62,14 21.12,14 | 21.12,14 22.75,14 v23,14.25 23.12,14.25 23.62,14.75 27.62,14.75 | 13.31,11.81 12,10.5 J1.1 | 21.12,14 v21.12,15 | 15.62,14 v15.62,19.5 | 13.31,11.81 14.62,10.5 J1.2 | K2.4 53.12,6.62 51.88,5.38 43.5,5.38 42.25,6.62 K1.4 42.12,6.75 34.12,14.75 27.62,14.75 | v27.62,14.62 27.62,14.75
  pour Top: -0.5,70.75 99,70.75 100.75,69 100.75,0.75 99.25,-0.75 0.5,-0.75 -0.75,0.5 -0.75,70.5
  pour Bottom: -0.5,70.75 99,70.75 100.75,69 100.75,0.75 99.25,-0.75 0.5,-0.75 -0.75,0.5 -0.75,70.5
GPS_1PPS  (via drill 0.3)
  Top 0.152: v78.25,6 78.25,5.38 78.62,5 R16.1 | v74.88,9.25 72.62,11.5 72.62,52.38 71.75,53.25 MODULE1.6
  Bottom 0.152: v78.25,6 75,9.25 v74.88,9.25
GPS_RESET  (via drill 0.3)
  Top 0.152: MODULE1.10 79.25,52.75 v79.25,25.88
  Bottom 0.152: v79.25,25.88 68.38,15 58.75,15 X1.22
GPS_UART0_RX
  Top 0.152: MODULE1.1 71.75,66 73.25,64.5 73.25,55.38 72,54.12 68.88,54.12 68.88,41.62 63.62,36.38 59.88,36.38 59.88,34 58.75,32.88 X1.8
GPS_UART0_TX  (via drill 0.3)
  Top 0.152: v73.62,33.62 73.62,66.88 70.38,66.88 70.12,66.62 70.12,65.12 71.62,63.62 MODULE1.2
  Bottom 0.152: v73.62,33.62 70.25,30.25 58.75,30.25 X1.10
N$1
  Top 0.152: R7.2 36.62,11.5 36,10.88 36,8.5 42.12,2.38 K1.3
N$2
  Top 0.152: TX.+ 26.88,15 26.88,16.5 R4.1
N$4
  Top 0.203: R12.2 66.12,46.5 63.62,44 63.62,43.62 Q2.1
N$5  (via drill 0.3)
  Top 0.203: D3.A 59,54.25 | 59,54.25 59,53.62 59.12,53.5 R9.2 | v58.5,54.25 59,54.25 | v40.88,49.62 33.38,42.12 33.38,38.25 34.75,36.88 RELAY2.3
  Bottom 0.203: v58.5,54.25 53.88,49.62 v40.88,49.62
N$6
  Top 0.203: R8.1 53.12,53.5 53,53.38 53,50.5 Q1.3
N$7  (via drill 0.3)
  Top 0.203: D2.A 54.5,55 | 54.5,55 54.5,53.75 R8.2 | v52.75,55 54.5,55
  Bottom 0.203: v52.75,55 36.12,55 34.88,53.75 RELAY1.3
N$8
  Top 0.203: R9.1 60.88,53.5 61.38,53 61.38,44.5 Q2.3
N$9
  Top 0.152: PPS.+ 80.38,2 80.38,5 R16.2
N$10  (via drill 0.3)
  Top 0.152: v17.25,45.38 7.12,55.5 7.12,64.75 4.38,67.5 STATUS1.+ | v62.5,31.62 72.25,21.88 72.25,9.25 76,5.5 76,2.75 | 76,2.75 76,2.62 75.38,2 STATUS.+ | 76,2.75 R17.2
  Bottom 0.152: v17.25,45.38 23.25,39.38 34.62,39.38 40.12,33.88 56.62,33.88 57.5,33 57.5,31.62 v62.5,31.62
N$11
  Top 0.152: R3.1 R42.1
N$12
  Top 0.152: R14.2 61.5,57.88 63.12,57.88 63.12,58 R1LED.-
N$13
  Top 0.152: R15.2 67,41.75 68.5,41.75 68.5,52.38 65.12,55.75 63.25,55.75 R2LED.-
N$14
  Top 0.406: C24.2 92,63.25 92.25,63 92.25,62.01 R24.1 90.75,62 89.23,63.52 MODULE1.11
N$15
  Top 0.152: R5.1 RX.+
N$16
  Top 0.152: U1.7 15.5,23 15.12,23 14.38,23.75 14.38,23.88 C1.2 12.5,37.5 16.62,41.62 X2.2
N$17
  Top 0.152: 16.62,21 16,21.62 15.62,21.62 U1.8 | 16.62,21 16.75,20.88 16.75,18.88 14.25,18.88 12.5,20.62 C2.2 | 16.62,21 17.62,22 17.62,36 16.75,36.88 X2.1
N$18
  Top 0.406: C23.2 94,63.25 93.75,63 93.75,62.01 | 93.75,62.01 R24.2 | X3.1 94.88,61.87 94.75,62 R24.2 | R24.2 93.75,62.01
N$19
  Top 0.152: R6.1 INT.+
N$20  (via drill 0.3)
  Top 0.152: v26,14.12 26,17.25 R1.1 | v15.75,13.38 14.75,14.38 U2.8
  Bottom 0.152: v26,14.12 25.25,13.38 v15.75,13.38
N$23
  Top 0.203: R10.2 55.12,49.5 Q1.1
N$24  (via drill 0.3)
  Top 0.152: v23.25,35.5 23.25,37.62 22.38,38.5 R21.2
  Bottom 0.152: v23.25,35.5 25.5,33.25 CN2.1
N$25
  Top 0.152: R22.2 49,10.75 49,6.5 53.12,2.38 K2.3
N$29
  Top 0.152: POWER.+ 70.38,2 70.38,4.5 R19.2
N$30
  Top 0.152: R3.2 P1.1
N$40  (via drill 0.3)
  Top 0.152: U8.2 93.88,18.88 v93.88,18 | v95.38,17 95.62,16.75 95.62,16 C18.2 95.75,13.25 96.5,12.5 X4.1
  Bottom 0.152: v93.88,18 94.88,17 v95.38,17
N$41
  Top 0.152: U8.1 93.25,17 C17.2 | C17.2 94.25,13.25 93.5,12.5 X4.2 | C17.2
N$45
  Top 0.152: R42.2 R43.1
N$49  (via drill 0.3)
  Top 0.152: D5.- C19.1 90,24.25 90,22.88 | U8.8 93.12,22.12 v93.12,22.88 | 90,22.88 v91.25,22.88 | D6.- 90,22.88
  Bottom 0.152: v91.25,22.88 v93.12,22.88
NC1
  Bottom 0.152: CHANNEL1.1 33.5,54.25 33.38,54.12 33.38,52.25 45.5,52.25 46.88,53.62 RELAY1.5
NC2
  Top 0.152: CHANNEL2.1 48.75,65.25 48.75,38.62 47,36.88 RELAY2.5
NO1
  Top 0.152: CHANNEL1.3 36.62,63.38 36.62,56.5 46.88,46.25 46.88,41.75 RELAY1.4
NO2
  Top 0.152: CHANNEL2.3 48.25,58.75 48.25,40 45.62,37.38 45.62,26.12 46.88,24.88 RELAY2.4
POWERLED  (via drill 0.3)
  Top 0.152: v60.12,17.75 60.12,13 68.62,4.5 R19.1
  Bottom 0.152: v60.12,17.75 59,18.88 57.38,18.88 56.25,20 X1.17
RELAY1  (via drill 0.3)
  Top 0.203: 57.88,52.75 57.88,53.5 R11.1 | 57.88,52.75 57.88,50.38 R10.1 | v63.62,56.88 R1LED.+ | 57.88,52.75 v58.5,52.75
  Bottom 0.203: v63.62,56.88 59.5,52.75 v58.5,52.75
RELAY2
  Top 0.152: 64.88,49.5 67.75,46.62 R12.1 | 64.88,49.5 64.88,55 R2LED.+ | 64.88,49.5 R13.2
RFIDTX  (via drill 0.3)
  Top 0.152: R21.1 R20.2 20.62,40.5 19.62,41.5 19.62,52.25 18.88,53 CN1.3 | R21.1 v20.75,35.12 | R21.1
  Bottom 0.152: v20.75,35.12 26.62,29.25 54.62,29.25 56.12,27.75 X1.11
RST_N  (via drill 0.3)
  Top 0.152: v28.62,31.62 28.62,32.25 29,32.62 R2.1 | v26.88,29.88 25.5,29.88 25.5,29.38 U1.17
  Bottom 0.152: v26.88,29.88 v28.62,31.62 29.25,32.25 55.62,32.25 56.12,32.75 X1.7
RTC_SCL  (via drill 0.3)
  Top 0.152: R31.1 R38.1 | U8.6 94.38,22.12 v94.38,24.62 94.38,24.88 94.5,25 94.5,27.75 R39.2 | v90.62,24.62 R31.1 | R31.1 | U3.6 52.25,18.25 54.25,18.25 54.25,37.62 55.62,39 57.38,39 57.38,36.5 56.25,35.38 X1.5
  Bottom 0.152: v94.38,24.62 v90.62,24.62 81,34.25 59.25,34.25 59.12,34.12 57.38,34.12 56.25,35.25 X1.5 56.12,35.38 39.12,35.38 32.62,41.88 25.38,41.88 20.25,47 2.62,47 2.62,51.25 4,52.62 J3.3
RTC_SDA  (via drill 0.3)
  Top 0.152: U8.5 95.25,22.5 R33.1 95.38,25.5 96,26.12 96,30.88 95.38,31.5 R41.2 95.25,32.25 90.5,32.25 R40.1 v88.12,31.5 | U3.7 52.12,18.62 51.5,18.62 51.5,17.88 51.62,17.75 54.62,17.75 54.62,36.25 56.12,37.75 X1.3
  Bottom 0.152: 59.88,39 59.88,40.88 59.25,41.5 58.38,41.5 50.88,49 5.12,49 4,50.12 J3.4 | 59.88,39 57.38,39 56.25,37.88 X1.3 | v88.12,31.5 80.62,39 59.88,39
RX_CAN  (via drill 0.3)
  Top 0.152: RX.- 20.12,18 20.12,18.12 U2.4 20,18.25 v20,19.25 | v17,22.25 17,29.25 15.62,29.25 U1.2
  Bottom 0.152: v20,19.25 v17,22.25
STATUSLED  (via drill 0.3)
  Top 0.152: v71.62,19.12 71.62,8.62 R17.1
  Bottom 0.152: v71.62,19.12 66.75,24 57.75,24 56.62,25.12 56.25,25.12 X1.13
TX_CAN
  Top 0.152: 20.12,14.12 20.12,14.38 U2.1 20.12,14.12 | 20.12,14.12 20.12,12.75 24.25,12.75 24.5,13 24.5,14.38 25.12,15 TX.- | 20.12,14.12 18.75,15.5 18.75,37.88 16.25,37.88 15.62,37.25 15.62,30.62 U1.1
V+  (via drill 0.3)
  Top 0.305: U4.1 69.62,22.75 C7.2 66.38,22.75 v61.38,22.75 | D1.- 34.5,15.62 36.62,17.75 36.62,20 37,20.38 38.88,20.38 38.88,16.62 C5.P$P 39,16.5 v43.75,21.25 45.38,21.25 49.25,25.12 49.25,58.75 J2.1
  Bottom 0.305: v61.38,22.75 59.88,21.25 v43.75,21.25
V_OBD
  Top 0.305: D1.+ 30,15.5 24.38,9.88 24.38,9.38 22.62,7.62 21.75,7.62 J1.9

### Text on the board
silktop: GPS | External / Control | Power | Relay 2 | + | ANT | Relay 1 | SEEED RFID | I2C Header | Orange Pi Zero Header | CR1220 / Battery for RTC | RDM6300 RFID | SUPPORT | CAN BUS | OpenAuto.ch / Car Sharing PCB / V1.1 | CAN to Vehicle | J.Devine / CERN OHL v1.2 | CAN | 15V Max | +V
silkbottom: http://github.com / /pingud98 / /OpenAutoChPiHat